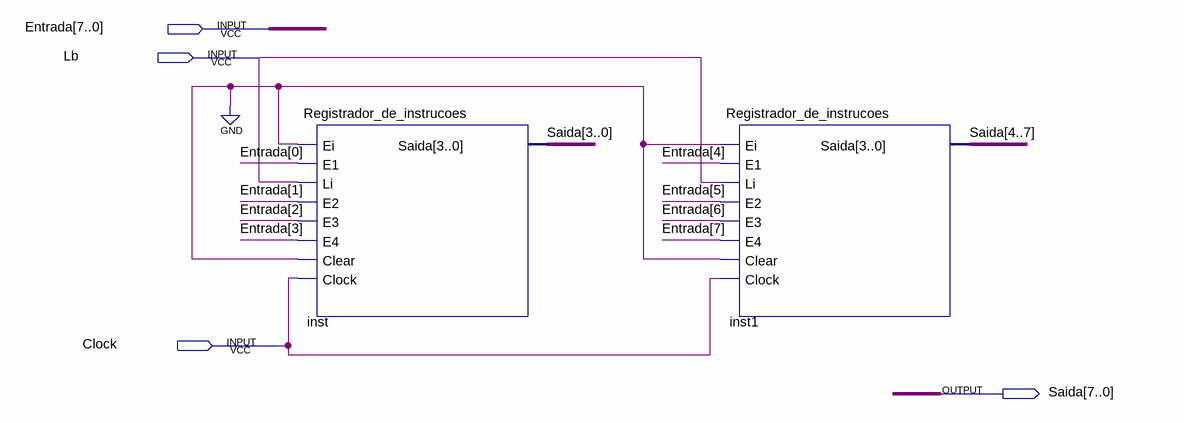
[diagram p0: schematic sheet]
// Quartus schematic Registrador_B.bdf as structural Verilog: 2 symbols, 4 pins
module Registrador_B (
  input  [7:0] Entrada,
  input  Lb,
  input  Clock,
  output [7:0] Saida
);

  Registrador_de_instrucoes inst (
    .Ei(1'b0), .E1(Entrada[0]), .Li(Lb), .E2(Entrada[1]), .E3(Entrada[2]), .E4(Entrada[3]), .Clear(1'b0),
    .Clock(Clock), .Saida(Saida[3:0]));
  Registrador_de_instrucoes inst1 (
    .Ei(1'b0), .E1(Entrada[4]), .Li(Lb), .E2(Entrada[5]), .E3(Entrada[6]), .E4(Entrada[7]), .Clear(1'b0),
    .Clock(Clock), .Saida({Saida[4], Saida[5], Saida[6], Saida[7]}));
endmodule
